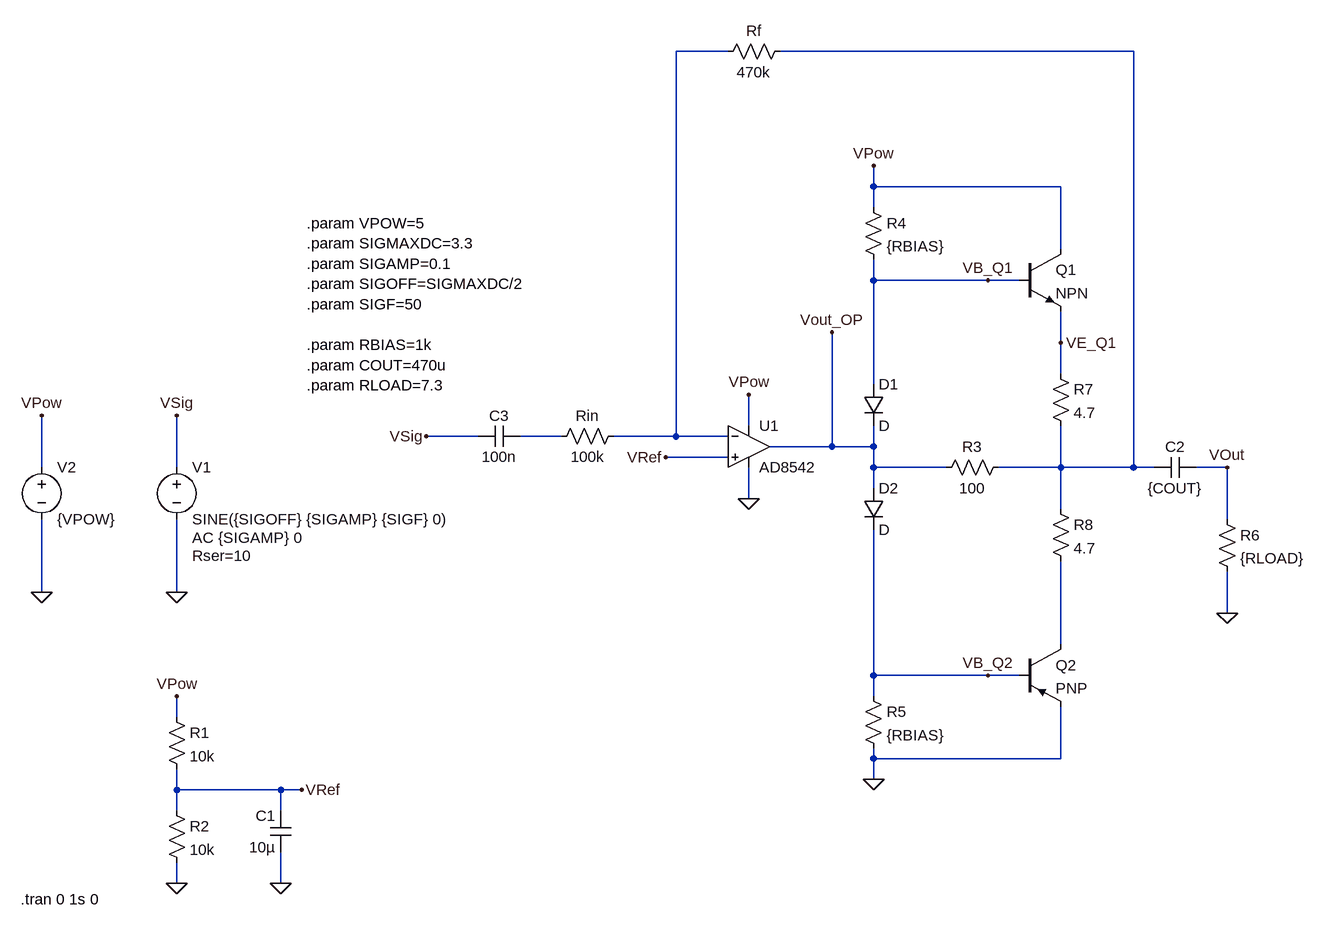
[diagram p0: schematic shiddy amplifier.asc]
shiddy amplifier.asc, the LTspice schematic file:
Version 4.1
SHEET 1 1636 1048
WIRE 736 -272 656 -272
WIRE 1360 -272 816 -272
WIRE 960 -64 960 -96
WIRE 1248 -64 960 -64
WIRE 960 -32 960 -64
WIRE 1248 32 1248 -64
WIRE 960 80 960 48
WIRE 1136 80 960 80
WIRE 1184 80 1136 80
WIRE 1248 176 1248 128
WIRE 1248 224 1248 176
WIRE 960 240 960 80
WIRE 768 304 768 256
WIRE 352 320 272 320
WIRE 480 320 416 320
WIRE 656 320 656 -272
WIRE 656 320 560 320
WIRE 736 320 656 320
WIRE 896 336 896 160
WIRE 896 336 800 336
WIRE 960 336 960 304
WIRE 960 336 896 336
WIRE 736 352 640 352
WIRE -320 368 -320 288
WIRE -112 368 -112 288
WIRE 960 368 960 336
WIRE 1072 368 960 368
WIRE 1248 368 1248 304
WIRE 1248 368 1152 368
WIRE 1360 368 1360 -272
WIRE 1360 368 1248 368
WIRE 1392 368 1360 368
WIRE 1504 368 1456 368
WIRE 960 400 960 368
WIRE 768 416 768 368
WIRE 1248 432 1248 368
WIRE 1504 448 1504 368
WIRE -320 560 -320 448
WIRE -112 560 -112 448
WIRE 1504 592 1504 528
WIRE 1248 640 1248 512
WIRE 960 688 960 464
WIRE 1136 688 960 688
WIRE 1184 688 1136 688
WIRE 960 720 960 688
WIRE -112 752 -112 720
WIRE 960 816 960 800
WIRE 1248 816 1248 736
WIRE 1248 816 960 816
WIRE 960 848 960 816
WIRE -112 864 -112 832
WIRE 48 864 -112 864
WIRE 80 864 48 864
WIRE -112 896 -112 864
WIRE 48 896 48 864
WIRE -112 1008 -112 976
WIRE 48 1008 48 960
FLAG -112 560 0
FLAG -320 560 0
FLAG -320 288 VPow
FLAG -112 288 VSig
FLAG -112 1008 0
FLAG -112 720 VPow
FLAG 768 256 VPow
FLAG 768 416 0
FLAG 80 864 VRef
FLAG 640 352 VRef
FLAG 272 320 VSig
FLAG 960 -96 VPow
FLAG 960 848 0
FLAG 1504 592 0
FLAG 1504 368 VOut
FLAG 48 1008 0
FLAG 896 160 Vout_OP
FLAG 1136 80 VB_Q1
FLAG 1248 176 VE_Q1
FLAG 1136 688 VB_Q2
SYMBOL voltage -112 352 R0
WINDOW 123 24 124 Left 2
WINDOW 39 24 152 Left 2
SYMATTR InstName V1
SYMATTR Value SINE({SIGOFF} {SIGAMP} {SIGF} 0)
SYMATTR Value2 AC {SIGAMP} 0
SYMATTR SpiceLine Rser=10
SYMBOL OpAmps\\AD8542 768 272 R0
SYMATTR InstName U1
SYMBOL voltage -320 352 R0
WINDOW 123 0 0 Left 0
WINDOW 39 0 0 Left 0
SYMATTR InstName V2
SYMATTR Value {VPOW}
SYMBOL res -128 736 R0
SYMATTR InstName R1
SYMATTR Value 10k
SYMBOL res -128 880 R0
SYMATTR InstName R2
SYMATTR Value 10k
SYMBOL cap 64 960 R180
WINDOW 0 24 56 Left 2
WINDOW 3 24 8 Left 2
SYMATTR InstName C1
SYMATTR Value 10µ
SYMBOL res 832 -288 R90
WINDOW 0 0 56 VBottom 2
WINDOW 3 32 56 VTop 2
SYMATTR InstName Rf
SYMATTR Value 470k
SYMBOL res 576 304 R90
WINDOW 0 0 56 VBottom 2
WINDOW 3 32 56 VTop 2
SYMATTR InstName Rin
SYMATTR Value 100k
SYMBOL npn 1184 32 R0
SYMATTR InstName Q1
SYMBOL pnp 1184 640 R0
SYMATTR InstName Q2
SYMBOL res 1168 352 R90
WINDOW 0 0 56 VBottom 2
WINDOW 3 32 56 VTop 2
SYMATTR InstName R3
SYMATTR Value 100
SYMBOL diode 944 240 R0
SYMATTR InstName D1
SYMBOL diode 944 400 R0
SYMATTR InstName D2
SYMBOL res 944 -48 R0
SYMATTR InstName R4
SYMATTR Value {RBIAS}
SYMBOL res 944 704 R0
SYMATTR InstName R5
SYMATTR Value {RBIAS}
SYMBOL res 1488 432 R0
SYMATTR InstName R6
SYMATTR Value {RLOAD}
SYMBOL cap 1456 352 R90
WINDOW 0 0 32 VBottom 2
WINDOW 3 32 32 VTop 2
SYMATTR InstName C2
SYMATTR Value {COUT}
SYMBOL res 1232 208 R0
SYMATTR InstName R7
SYMATTR Value 4.7
SYMBOL res 1232 416 R0
SYMATTR InstName R8
SYMATTR Value 4.7
SYMBOL cap 416 304 R90
WINDOW 0 0 32 VBottom 2
WINDOW 3 32 32 VTop 2
SYMATTR InstName C3
SYMATTR Value 100n
TEXT 88 -8 Left 2 !.param VPOW=5\n.param SIGMAXDC=3.3\n.param SIGAMP=0.1\n.param SIGOFF=SIGMAXDC/2\n.param SIGF=50\n \n.param RBIAS=1k\n.param COUT=470u\n.param RLOAD=7.3
TEXT -352 1032 Left 2 !.tran 0 1s 0

The netlist it stands for:
* shiddy amplifier.asc
V1 VSig 0 SINE({SIGOFF} {SIGAMP} {SIGF} 0) AC {SIGAMP} 0 Rser=10
X§U1 VRef N001 VPow 0 Vout_OP AD8542  ; pins In+ In- V+ V- OUT
V2 VPow 0 {VPOW}
R1 VPow VRef 10k
R2 VRef 0 10k
C1 0 VRef 10µ
Rf N002 N001 470k
Rin N001 N003 100k
Q1 VPow VB_Q1 VE_Q1 0 NPN
Q2 N004 VB_Q2 0 0 PNP
R3 N002 Vout_OP 100
D1 VB_Q1 Vout_OP D
D2 Vout_OP VB_Q2 D
R4 VPow VB_Q1 {RBIAS}
R5 VB_Q2 0 {RBIAS}
R6 VOut 0 {RLOAD}
C2 VOut N002 {COUT}
R7 VE_Q1 N002 4.7
R8 N002 N004 4.7
C3 N003 VSig 100n
.model D D
.lib standard.dio
.model NPN NPN
.model PNP PNP
.lib standard.bjt
.param VPOW=5
.param SIGMAXDC=3.3
.param SIGAMP=0.1
.param SIGOFF=SIGMAXDC/2
.param SIGF=50
.param RBIAS=1k
.param COUT=470u
.param RLOAD=7.3
.tran 0 1s 0
.lib AD8542.sub
.backanno
.end